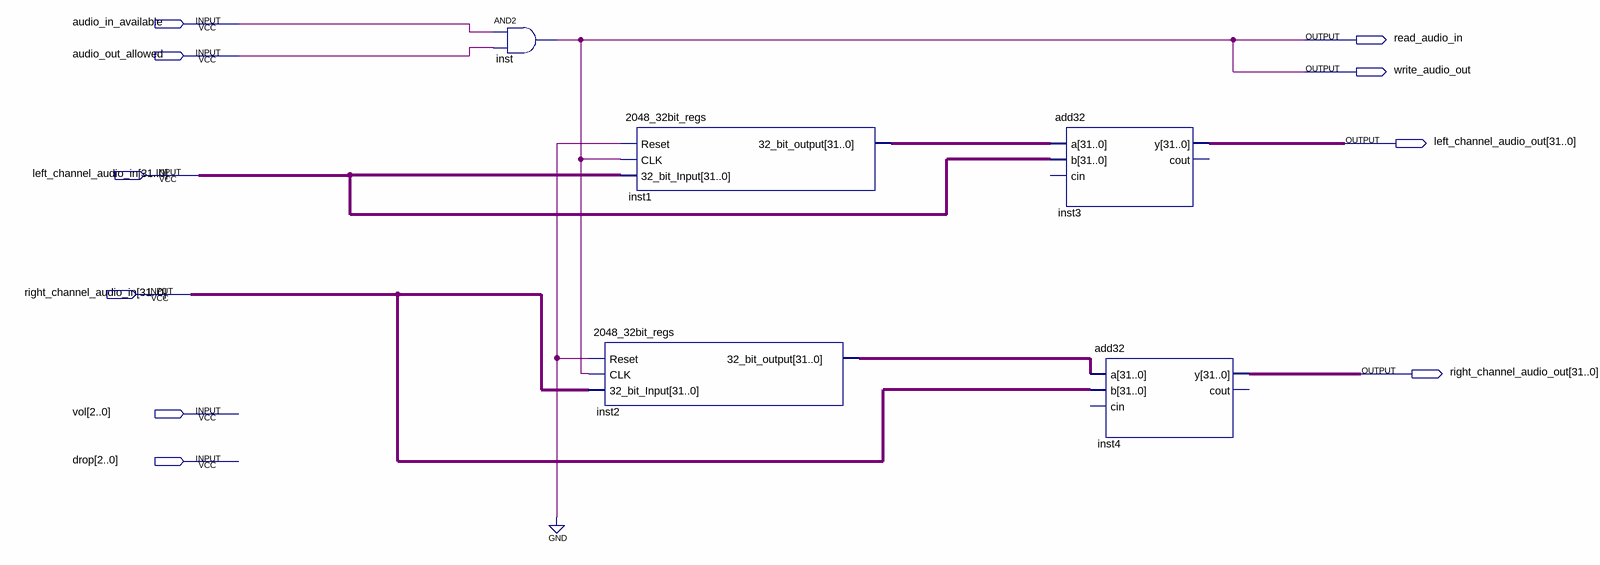
[diagram p0: schematic sheet]
// Quartus schematic filter_demo.bdf as structural Verilog: 5 symbols, 10 pins
module filter_demo (
  input  audio_in_available,
  input  audio_out_allowed,
  input  [31:0] left_channel_audio_in,
  input  [31:0] right_channel_audio_in,
  input  [2:0] vol,
  input  [2:0] drop,
  output read_audio_in,
  output write_audio_out,
  output [31:0] left_channel_audio_out,
  output [31:0] right_channel_audio_out
);

  wire [31:0] inst1_32_bit_output, inst2_32_bit_output;

  and inst (read_audio_in, audio_in_available, audio_out_allowed);
  \2048_32bit_regs  inst2 (
    .Reset(1'b0), .CLK(read_audio_in), .\32_bit_Input (right_channel_audio_in),
    .\32_bit_output (inst2_32_bit_output));
  \2048_32bit_regs  inst1 (
    .Reset(1'b0), .CLK(read_audio_in), .\32_bit_Input (left_channel_audio_in),
    .\32_bit_output (inst1_32_bit_output));
  add32 inst3 (.a(inst1_32_bit_output), .b(left_channel_audio_in), .y(left_channel_audio_out));  // open: cin, cout
  add32 inst4 (.a(inst2_32_bit_output), .b(right_channel_audio_in), .y(right_channel_audio_out));  // open: cin, cout

  assign write_audio_out = read_audio_in;
endmodule
